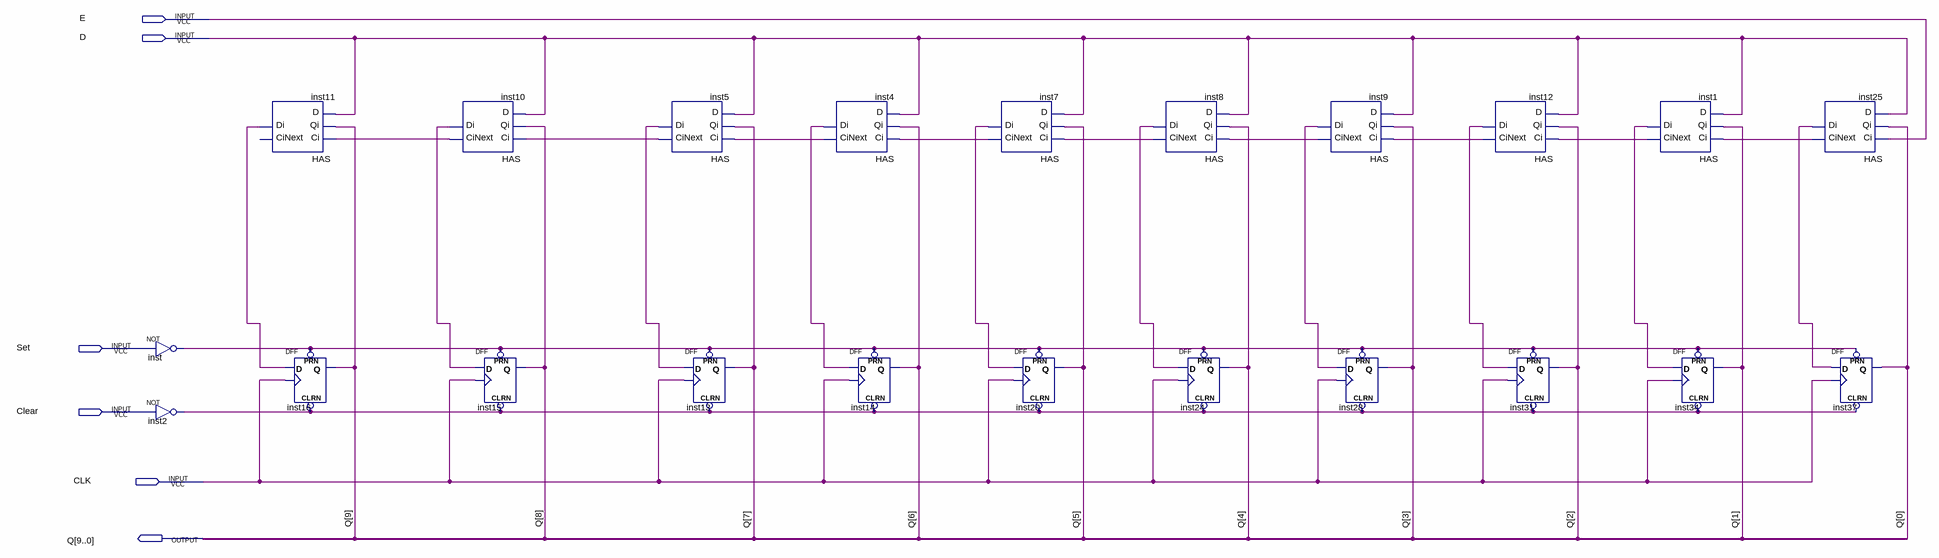
[diagram p0: schematic sheet]
// Quartus schematic COUNTERupdown.bdf as structural Verilog: 22 symbols, 6 pins
module COUNTERupdown (
  input  E,
  input  D,
  input  Set,
  input  Clear,
  input  CLK,
  output [9:0] Q
);

  wire inst1_cinext, inst1_di, inst2_out, inst4_cinext, inst4_di, inst5_cinext, inst5_di, inst7_cinext,
       inst7_di, inst8_cinext, inst8_di, inst9_cinext, inst9_di, inst10_cinext, inst10_di, inst11_di,
       inst12_cinext, inst12_di, inst25_cinext, inst25_di, inst_out;

  not inst (inst_out, Set);
  not inst2 (inst2_out, Clear);
  HAS inst11 (.Ci(inst10_cinext), .Qi(Q[9]), .D(D), .Di(inst11_di));  // open: CiNext
  DFF inst16 (.CLRN(inst2_out), .CLK(CLK), .D(inst11_di), .PRN(inst_out), .Q(Q[9]));
  HAS inst10 (.Ci(inst5_cinext), .Qi(Q[8]), .D(D), .CiNext(inst10_cinext), .Di(inst10_di));
  DFF inst15 (.CLRN(inst2_out), .CLK(CLK), .D(inst10_di), .PRN(inst_out), .Q(Q[8]));
  HAS inst5 (.Ci(inst4_cinext), .Qi(Q[7]), .D(D), .CiNext(inst5_cinext), .Di(inst5_di));
  DFF inst13 (.CLRN(inst2_out), .CLK(CLK), .D(inst5_di), .PRN(inst_out), .Q(Q[7]));
  HAS inst4 (.Ci(inst7_cinext), .Qi(Q[6]), .D(D), .CiNext(inst4_cinext), .Di(inst4_di));
  DFF inst14 (.CLRN(inst2_out), .CLK(CLK), .D(inst4_di), .PRN(inst_out), .Q(Q[6]));
  HAS inst7 (.Ci(inst8_cinext), .Qi(Q[5]), .D(D), .CiNext(inst7_cinext), .Di(inst7_di));
  DFF inst20 (.CLRN(inst2_out), .CLK(CLK), .D(inst7_di), .PRN(inst_out), .Q(Q[5]));
  HAS inst8 (.Ci(inst9_cinext), .Qi(Q[4]), .D(D), .CiNext(inst8_cinext), .Di(inst8_di));
  DFF inst24 (.CLRN(inst2_out), .CLK(CLK), .D(inst8_di), .PRN(inst_out), .Q(Q[4]));
  HAS inst9 (.Ci(inst12_cinext), .Qi(Q[3]), .D(D), .CiNext(inst9_cinext), .Di(inst9_di));
  DFF inst28 (.CLRN(inst2_out), .CLK(CLK), .D(inst9_di), .PRN(inst_out), .Q(Q[3]));
  HAS inst12 (.Ci(inst1_cinext), .Qi(Q[2]), .D(D), .CiNext(inst12_cinext), .Di(inst12_di));
  DFF inst31 (.CLRN(inst2_out), .CLK(CLK), .D(inst12_di), .PRN(inst_out), .Q(Q[2]));
  HAS inst1 (.Ci(inst25_cinext), .Qi(Q[1]), .D(D), .CiNext(inst1_cinext), .Di(inst1_di));
  DFF inst34 (.CLRN(inst2_out), .CLK(CLK), .D(inst1_di), .PRN(inst_out), .Q(Q[1]));
  HAS inst25 (.Ci(E), .Qi(Q[0]), .D(D), .CiNext(inst25_cinext), .Di(inst25_di));
  DFF inst37 (.CLRN(inst2_out), .CLK(CLK), .D(inst25_di), .PRN(inst_out), .Q(Q[0]));
endmodule
